# Altium schematic sheet LN_LDO.SchDoc
size A4; SheetNumber: 6; SheetTotal: 7
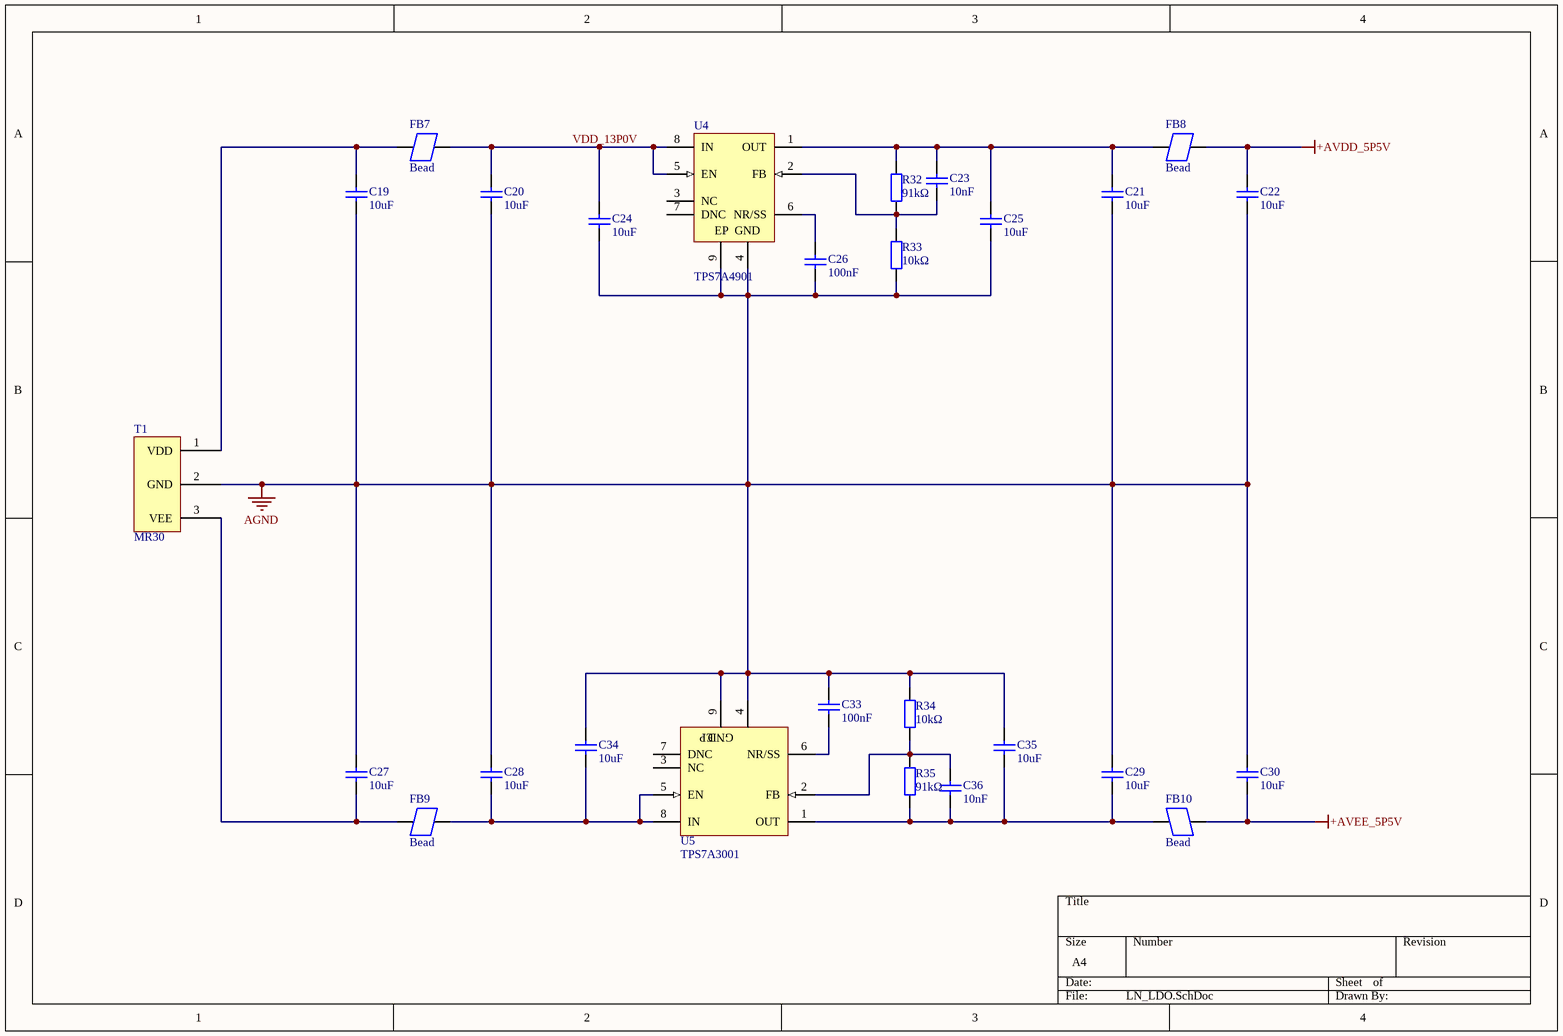
[diagram p0: LN_LDO.SchDoc]

## Parts
C19  10uF  [0805_C]
C20  10uF  [0805_C]
C21  10uF  [0805_C]
C22  10uF  [0805_C]
C23  10nF  [0603_C]
C24  10uF  [0805_C]
C25  10uF  [0805_C]
C26  100nF  [0603_C]
C27  10uF  [0805_C]
C28  10uF  [0805_C]
C29  10uF  [0805_C]
C30  10uF  [0805_C]
C33  100nF  [0603_C]
C34  10uF  [0805_C]
C35  10uF  [0805_C]
C36  10nF  [0603_C]
FB7  Bead  [0805_L]
FB8  Bead  [0805_L]
FB9  Bead  [0805_L]
FB10  Bead  [0805_L]
R32  91kΩ  [0603_R]
R33  10kΩ  [0603_R]
R34  10kΩ  [0603_R]
R35  91kΩ  [0603_R]
T1  MR30  [MR30PW-M]
U4  TPS7A4901  [DGN0008D_L]
U5  TPS7A3001  [DGN0008D_L]

## Nets
+AVDD_5P5V: C22.2 FB8.1
+AVEE_5P5V: C30.1 FB10.1
AGND: C19.1 C20.1 C21.1 C22.1 C24.1 C25.1 C26.1 C27.2 C28.2 C29.2 C30.2 C33.1 C34.1 C35.1 R33.1 R34.1 T1.2(GND) U4.4(GND) U4.9(EP) U5.4(GND) U5.9(EP)
VDD_13P0V: C20.2 C24.2 FB7.1 U4.5(EN) U4.8(IN)
NetC19_2: C19.2 FB7.2 T1.1(VDD)
NetC21_2: C21.2 C23.2 C25.2 FB8.2 R32.2 U4.1(OUT)
NetC23_1: C23.1 R32.1 R33.2 U4.2(FB)
NetC26_2: C26.2 U4.6(NR/SS)
NetC27_1: C27.1 FB9.1 T1.3(VEE)
NetC28_1: C28.1 C34.2 FB9.2 U5.5(EN) U5.8(IN)
NetC29_1: C29.1 C35.2 C36.2 FB10.2 R35.2 U5.1(OUT)
NetC33_2: C33.2 U5.6(NR/SS)
NetC36_1: C36.1 R34.2 R35.1 U5.2(FB)

Not connected (* = marked no-connect by the designer): U4 3(NC) 7(DNC); U5 3(NC) 7(DNC)

## Library data of the parts
C19-C22 C24 C25 C27-C30 C34 C35 = 0805 10uF (106) 10% 25V: 贴片电容; ComponentLink1Description: 供应商链接; ComponentLink1URL: http://www.szlcsc.com/product/details_16532.html; Package: 0805; Supplier: LC; SuppliersPartNumber: C15850
C23 C36 = 0603 10nF (103) 10% 50V: 贴片电容; ComponentLink1Description: 供应商链接; ComponentLink1URL: http://www.szlcsc.com/product/details_58143.html; Package: 0603; Supplier: LC; SuppliersPartNumber: C57112
C26 C33 = 0603 100nF (104) 10% 50V: 贴片电容; ComponentLink1Description: 供应商链接; ComponentLink1URL: http://www.szlcsc.com/product/details_15331.html; Package: 0603; Supplier: LC; SuppliersPartNumber: C14663
R32 R35 = 0603 91KΩ (9102) 1%: 贴片电阻; ComponentLink1Description: 供应商链接; ComponentLink1URL: http://www.szlcsc.com/product/details_23992.html; Package: 0603; Supplier: LC; SuppliersPartNumber: C23265
R33 R34 = 0603 10KΩ (1002) 1%: 贴片电阻; ComponentLink1Description: 供应商链接; ComponentLink1URL: http://www.szlcsc.com/product/details_26547.html; Package: 0603; Supplier: LC; SuppliersPartNumber: C25804